# Altium schematic sheet main.SchDoc
size A4
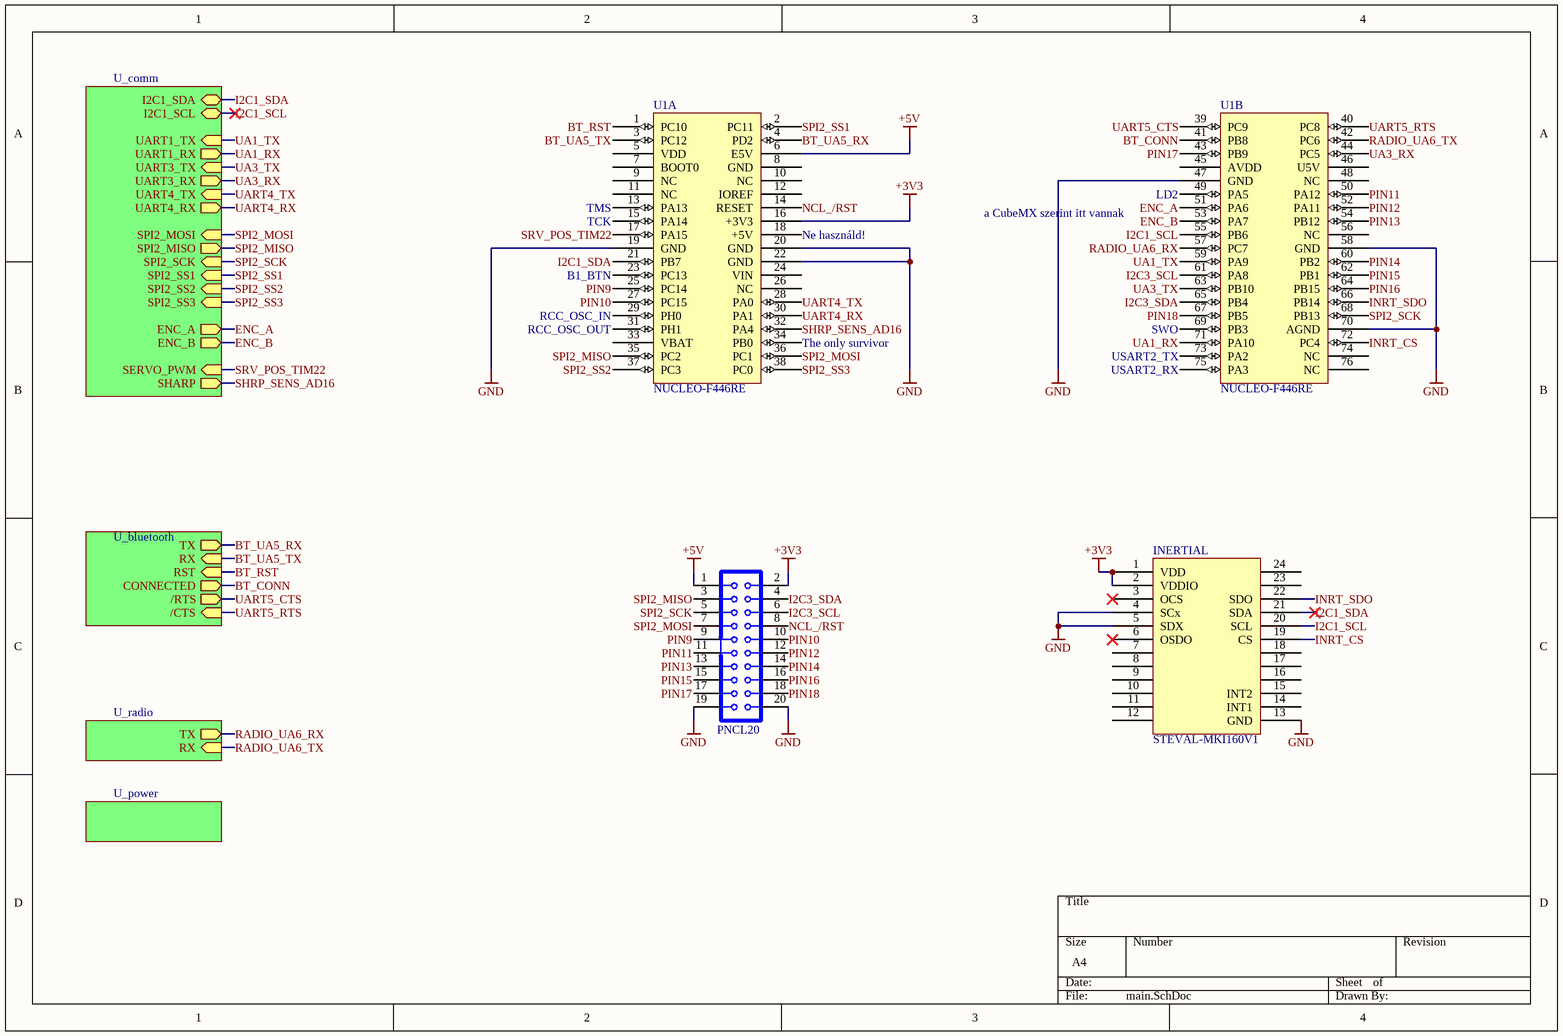
[diagram p0: main.SchDoc]

## Parts
INERTIAL  STEVAL-MKI160V1  [STEVAL-MKI160V1]
PNCL20  Ribbon cable 20  [HDR2X10]  (value not drawn)
U1  NUCLEO-F446RE  [FP_NUCLEO-64]  (parts A,B of 2)

## Sub-sheets
U_bluetooth = bluetooth.SchDoc: RX (in), TX (out), RST (in), CONNECTED (out), /RTS (out), /CTS (in)
U_comm = comm.SchDoc: I2C1_SDA (bidir), I2C1_SCL (bidir), UART1_TX (in), UART1_RX (out), SPI2_MOSI (in), SPI2_MISO (out), SPI2_SCK (in), SPI2_SS1 (in), SPI2_SS2 (in), SPI2_SS3 (in), ENC_A (out), ENC_B (out), SERVO_PWM (in), SHARP (out), UART3_TX (in), UART3_RX (out), UART4_TX (in), UART4_RX (out)
U_power = power.SchDoc: no entries
U_radio = radio.SchDoc: RX (in), TX (out)

## Nets
+3V3: INERTIAL.1(VDD) INERTIAL.2(VDDIO) PNCL20.2 U1.16(+3V3)
+5V: PNCL20.1 U1.6(E5V)
GND: INERTIAL.4(SCx) INERTIAL.5(SDX) INERTIAL.13(GND) PNCL20.19 PNCL20.20 U1.19(GND) U1.20(GND) U1.22(GND) U1.47(GND) U1.58(GND) U1.70(AGND)
BT_CONN: U1.41(PB8) ; sheet U_bluetooth/CONNECTED
BT_RST: U1.1(PC10) ; sheet U_bluetooth/RST
BT_UA5_RX: U1.4(PD2) ; sheet U_bluetooth/TX
BT_UA5_TX: U1.3(PC12) ; sheet U_bluetooth/RX
ENC_A: U1.51(PA6) ; sheet U_comm/ENC_A
ENC_B: U1.53(PA7) ; sheet U_comm/ENC_B
I2C1_SCL: INERTIAL.20(SCL) U1.55(PB6) ; sheet U_comm/I2C1_SCL
I2C1_SDA: INERTIAL.21(SDA) U1.21(PB7) ; sheet U_comm/I2C1_SDA
I2C3_SCL: PNCL20.6 U1.61(PA8)
I2C3_SDA: PNCL20.4 U1.65(PB4)
INRT_CS: INERTIAL.19(CS) U1.72(PC4)
INRT_SDO: INERTIAL.22(SDO) U1.66(PB14)
NCL_/RST: PNCL20.8 U1.14(RESET)
PIN9: PNCL20.9 U1.25(PC14)
PIN10: PNCL20.10 U1.27(PC15)
PIN11: PNCL20.11 U1.50(PA12)
PIN12: PNCL20.12 U1.52(PA11)
PIN13: PNCL20.13 U1.54(PB12)
PIN14: PNCL20.14 U1.60(PB2)
PIN15: PNCL20.15 U1.62(PB1)
PIN16: PNCL20.16 U1.64(PB15)
PIN17: PNCL20.17 U1.43(PB9)
PIN18: PNCL20.18 U1.67(PB5)
RADIO_UA6_RX: U1.57(PC7) ; sheet U_radio/TX
RADIO_UA6_TX: U1.42(PC6) ; sheet U_radio/RX
SHRP_SENS_AD16: U1.32(PA4) ; sheet U_comm/SHARP
SPI2_MISO: PNCL20.3 U1.35(PC2) ; sheet U_comm/SPI2_MISO
SPI2_MOSI: PNCL20.7 U1.36(PC1) ; sheet U_comm/SPI2_MOSI
SPI2_SCK: PNCL20.5 U1.68(PB13) ; sheet U_comm/SPI2_SCK
SPI2_SS1: U1.2(PC11) ; sheet U_comm/SPI2_SS1
SPI2_SS2: U1.37(PC3) ; sheet U_comm/SPI2_SS2
SPI2_SS3: U1.38(PC0) ; sheet U_comm/SPI2_SS3
SRV_POS_TIM22: U1.17(PA15) ; sheet U_comm/SERVO_PWM
UA1_RX: U1.71(PA10) ; sheet U_comm/UART1_RX
UA1_TX: U1.59(PA9) ; sheet U_comm/UART1_TX
UA3_RX: U1.44(PC5) ; sheet U_comm/UART3_RX
UA3_TX: U1.63(PB10) ; sheet U_comm/UART3_TX
UART4_RX: U1.30(PA1) ; sheet U_comm/UART4_RX
UART4_TX: U1.28(PA0) ; sheet U_comm/UART4_TX
UART5_CTS: U1.39(PC9) ; sheet U_bluetooth//RTS
UART5_RTS: U1.40(PC8) ; sheet U_bluetooth//CTS

Not connected (* = marked no-connect by the designer): INERTIAL 3(OCS)* 6(OSDO)* 7 8 9 10 11 12 14(INT1) 15(INT2) 16 17 18 23 24; U1 5(VDD) 7(BOOT0) 8(GND) 9(NC) 10(NC) 11(NC) 12(IOREF) 13(PA13) 15(PA14) 18(+5V) 23(PC13) 24(VIN) 26(NC) 29(PH0) 31(PH1) 33(VBAT) 34(PB0) 45(AVDD) 46(U5V) 48(NC) 49(PA5) 56(NC) 69(PB3) 73(PA2) 74(NC) 75(PA3) 76(NC)

## Notes on the sheet
- (near U1) TCK
- (near U1) TMS
- (near U1) Ne használd!
- a CubeMX szerint itt vannak
- (near U1) LD2
- (near U1) B1_BTN
- (near U1) RCC_OSC_IN
- (near U1) RCC_OSC_OUT
- (near U1) The only survivor
- (near U1) SWO
- (near U1) USART2_TX
- (near U1) USART2_RX

## Library data of the parts
PNCL20 = Ribbon cable 20: Part Class: Connector; Order Code: 43-00-14, 43-01-10; CompType: DH-20, FC-20; Distributor: Lomex
U1 = NUCLEO-F446RE: Reference: NUCLEO; Name: Nucleo F446RE; Supplier: Tanszék